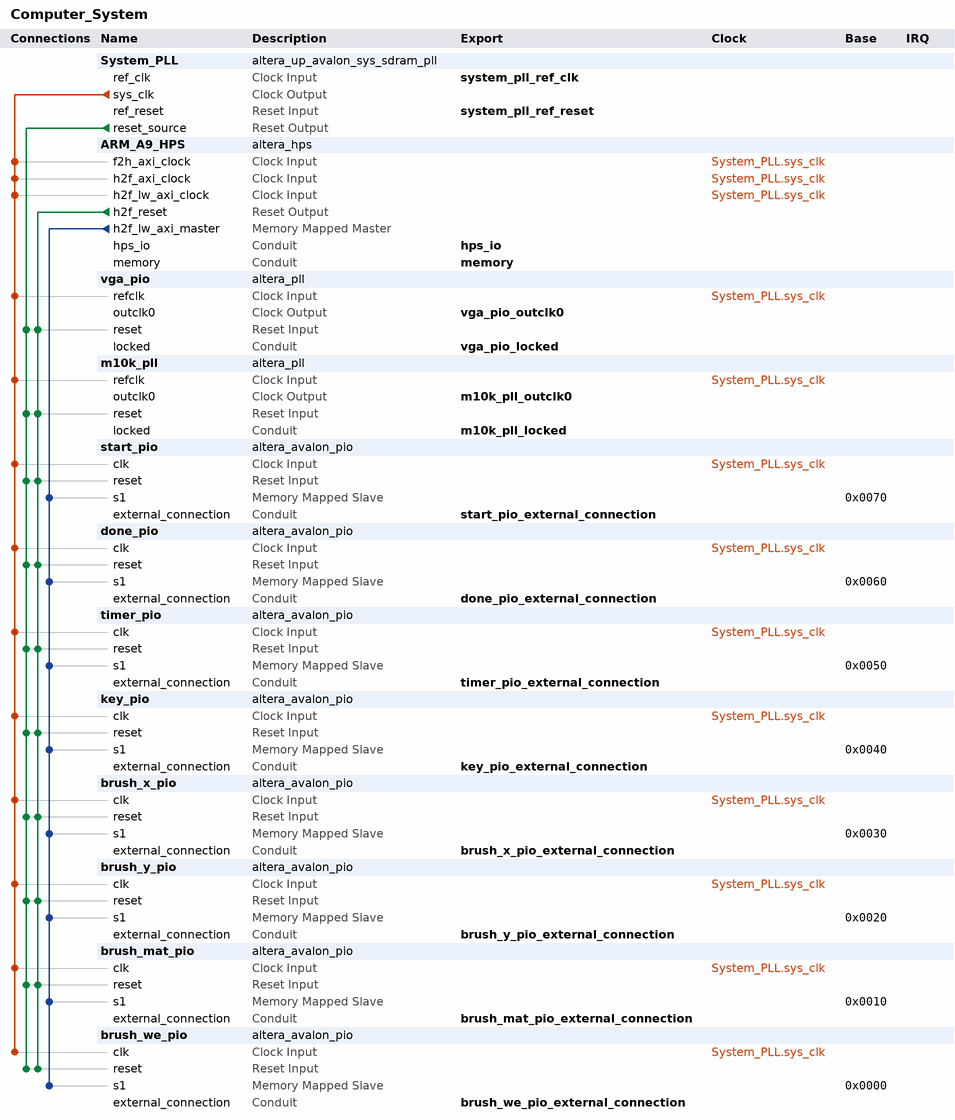
[diagram p0: system contents]
# Platform Designer (Qsys) system Computer_System, Cyclone V 5CSEMA5F31C6
# Parameters at their usual value, and those the tool derives, are not listed.
package require -exact qsys 18.1
create_system Computer_System
set_project_property DEVICE_FAMILY {Cyclone V}
set_project_property DEVICE 5CSEMA5F31C6

add_instance System_PLL altera_up_avalon_sys_sdram_pll 18.0
set_instance_parameter_value System_PLL CV_boards DE1-SoC
set_instance_parameter_value System_PLL gui_outclk 100.0
set_instance_parameter_value System_PLL gui_refclk 50.0

add_instance ARM_A9_HPS altera_hps 18.1
set_instance_parameter_value ARM_A9_HPS EMAC1_Mode RGMII
set_instance_parameter_value ARM_A9_HPS EMAC1_PinMuxing {HPS I/O Set 0}
set_instance_parameter_value ARM_A9_HPS F2SCLK_COLDRST_Enable false
set_instance_parameter_value ARM_A9_HPS F2SCLK_DBGRST_Enable false
set_instance_parameter_value ARM_A9_HPS F2SCLK_WARMRST_Enable false
set_instance_parameter_value ARM_A9_HPS F2SINTERRUPT_Enable true
set_instance_parameter_value ARM_A9_HPS F2S_Width 2
set_instance_parameter_value ARM_A9_HPS FPGA_PERIPHERAL_OUTPUT_CLOCK_FREQ_EMAC0_GTX_CLK 125
set_instance_parameter_value ARM_A9_HPS FPGA_PERIPHERAL_OUTPUT_CLOCK_FREQ_EMAC0_MD_CLK 100.0
set_instance_parameter_value ARM_A9_HPS FPGA_PERIPHERAL_OUTPUT_CLOCK_FREQ_EMAC1_GTX_CLK 125
set_instance_parameter_value ARM_A9_HPS FPGA_PERIPHERAL_OUTPUT_CLOCK_FREQ_EMAC1_MD_CLK 100.0
set_instance_parameter_value ARM_A9_HPS HPS_PROTOCOL DDR3
set_instance_parameter_value ARM_A9_HPS I2C0_Mode I2C
set_instance_parameter_value ARM_A9_HPS I2C0_PinMuxing {HPS I/O Set 0}
set_instance_parameter_value ARM_A9_HPS I2C1_Mode I2C
set_instance_parameter_value ARM_A9_HPS I2C1_PinMuxing {HPS I/O Set 0}
set_instance_parameter_value ARM_A9_HPS LWH2F_Enable true
set_instance_parameter_value ARM_A9_HPS MEM_BANKADDR_WIDTH 3
set_instance_parameter_value ARM_A9_HPS MEM_CLK_FREQ 400.0
set_instance_parameter_value ARM_A9_HPS MEM_COL_ADDR_WIDTH 10
set_instance_parameter_value ARM_A9_HPS MEM_DQ_WIDTH 32
set_instance_parameter_value ARM_A9_HPS MEM_DRV_STR RZQ/7
set_instance_parameter_value ARM_A9_HPS MEM_ROW_ADDR_WIDTH 15
set_instance_parameter_value ARM_A9_HPS MEM_RTT_NOM RZQ/4
set_instance_parameter_value ARM_A9_HPS MEM_RTT_WR RZQ/4
set_instance_parameter_value ARM_A9_HPS MEM_TCL 11
set_instance_parameter_value ARM_A9_HPS MEM_TFAW_NS 30.0
set_instance_parameter_value ARM_A9_HPS MEM_TRAS_NS 35.0
set_instance_parameter_value ARM_A9_HPS MEM_TRCD_NS 13.75
set_instance_parameter_value ARM_A9_HPS MEM_TRFC_NS 260.0
set_instance_parameter_value ARM_A9_HPS MEM_TRP_NS 13.75
set_instance_parameter_value ARM_A9_HPS MEM_VENDOR JEDEC
set_instance_parameter_value ARM_A9_HPS MEM_WTCL 8
set_instance_parameter_value ARM_A9_HPS QSPI_Mode {1 SS}
set_instance_parameter_value ARM_A9_HPS QSPI_PinMuxing {HPS I/O Set 0}
set_instance_parameter_value ARM_A9_HPS REF_CLK_FREQ 25.0
set_instance_parameter_value ARM_A9_HPS S2FCLK_USER2CLK 5
set_instance_parameter_value ARM_A9_HPS S2F_Width 3
set_instance_parameter_value ARM_A9_HPS SDIO_Mode {4-bit Data}
set_instance_parameter_value ARM_A9_HPS SDIO_PinMuxing {HPS I/O Set 0}
set_instance_parameter_value ARM_A9_HPS SPIM1_Mode {Single Slave Select}
set_instance_parameter_value ARM_A9_HPS SPIM1_PinMuxing {HPS I/O Set 0}
set_instance_parameter_value ARM_A9_HPS STM_Enable false
set_instance_parameter_value ARM_A9_HPS TIMING_BOARD_AC_SKEW 0.03
set_instance_parameter_value ARM_A9_HPS TIMING_BOARD_AC_TO_CK_SKEW 0.0
set_instance_parameter_value ARM_A9_HPS TIMING_BOARD_DQ_TO_DQS_SKEW 0.0
set_instance_parameter_value ARM_A9_HPS TIMING_BOARD_MAX_CK_DELAY 0.03
set_instance_parameter_value ARM_A9_HPS TIMING_BOARD_MAX_DQS_DELAY 0.02
set_instance_parameter_value ARM_A9_HPS TIMING_BOARD_SKEW_BETWEEN_DQS 0.08
set_instance_parameter_value ARM_A9_HPS TIMING_BOARD_SKEW_CKDQS_DIMM_MAX 0.16
set_instance_parameter_value ARM_A9_HPS TIMING_BOARD_SKEW_CKDQS_DIMM_MIN 0.09
set_instance_parameter_value ARM_A9_HPS TIMING_BOARD_SKEW_WITHIN_DQS 0.01
set_instance_parameter_value ARM_A9_HPS TIMING_TDH 65
set_instance_parameter_value ARM_A9_HPS TIMING_TDQSCK 255
set_instance_parameter_value ARM_A9_HPS TIMING_TDQSQ 125
set_instance_parameter_value ARM_A9_HPS TIMING_TDS 30
set_instance_parameter_value ARM_A9_HPS TIMING_TIH 140
set_instance_parameter_value ARM_A9_HPS TIMING_TIS 180
set_instance_parameter_value ARM_A9_HPS TIMING_TQSH 0.4
set_instance_parameter_value ARM_A9_HPS UART0_Mode {No Flow Control}
set_instance_parameter_value ARM_A9_HPS UART0_PinMuxing {HPS I/O Set 0}
set_instance_parameter_value ARM_A9_HPS USB1_Mode SDR
set_instance_parameter_value ARM_A9_HPS USB1_PinMuxing {HPS I/O Set 0}
set_instance_parameter_value ARM_A9_HPS desired_cfg_clk_mhz 100.0
set_instance_parameter_value ARM_A9_HPS desired_qspi_clk_mhz 400.0

add_instance vga_pio altera_pll 18.1
set_instance_parameter_value vga_pio gui_device_speed_grade 2
set_instance_parameter_value vga_pio gui_number_of_clocks 1
set_instance_parameter_value vga_pio gui_operation_mode direct
set_instance_parameter_value vga_pio gui_output_clock_frequency0 25.0
set_instance_parameter_value vga_pio gui_pll_mode {Integer-N PLL}
set_instance_parameter_value vga_pio gui_reference_clock_frequency 100.0
set_instance_parameter_value vga_pio gui_use_locked true

add_instance m10k_pll altera_pll 18.1
set_instance_parameter_value m10k_pll gui_device_speed_grade 2
set_instance_parameter_value m10k_pll gui_number_of_clocks 1
set_instance_parameter_value m10k_pll gui_operation_mode direct
set_instance_parameter_value m10k_pll gui_output_clock_frequency0 100.0
set_instance_parameter_value m10k_pll gui_pll_mode {Integer-N PLL}
set_instance_parameter_value m10k_pll gui_reference_clock_frequency 100.0
set_instance_parameter_value m10k_pll gui_use_locked true

add_instance start_pio altera_avalon_pio 18.1
set_instance_parameter_value start_pio direction Output
set_instance_parameter_value start_pio width 32

add_instance done_pio altera_avalon_pio 18.1
set_instance_parameter_value done_pio direction Input
set_instance_parameter_value done_pio width 1

add_instance timer_pio altera_avalon_pio 18.1
set_instance_parameter_value timer_pio direction Input
set_instance_parameter_value timer_pio width 32

add_instance key_pio altera_avalon_pio 18.1
set_instance_parameter_value key_pio direction Input
set_instance_parameter_value key_pio width 4

add_instance brush_x_pio altera_avalon_pio 18.1
set_instance_parameter_value brush_x_pio direction Output
set_instance_parameter_value brush_x_pio width 10

add_instance brush_y_pio altera_avalon_pio 18.1
set_instance_parameter_value brush_y_pio direction Output
set_instance_parameter_value brush_y_pio width 9

add_instance brush_mat_pio altera_avalon_pio 18.1
set_instance_parameter_value brush_mat_pio direction Output
set_instance_parameter_value brush_mat_pio width 5

add_instance brush_we_pio altera_avalon_pio 18.1
set_instance_parameter_value brush_we_pio direction Output
set_instance_parameter_value brush_we_pio width 1

# connections
add_connection System_PLL.sys_clk ARM_A9_HPS.f2h_axi_clock clock
add_connection System_PLL.sys_clk ARM_A9_HPS.h2f_axi_clock clock
add_connection System_PLL.sys_clk ARM_A9_HPS.h2f_lw_axi_clock clock
add_connection System_PLL.sys_clk brush_mat_pio.clk clock
add_connection System_PLL.sys_clk brush_we_pio.clk clock
add_connection System_PLL.sys_clk brush_x_pio.clk clock
add_connection System_PLL.sys_clk brush_y_pio.clk clock
add_connection System_PLL.sys_clk done_pio.clk clock
add_connection System_PLL.sys_clk key_pio.clk clock
add_connection System_PLL.sys_clk m10k_pll.refclk clock
add_connection System_PLL.sys_clk start_pio.clk clock
add_connection System_PLL.sys_clk timer_pio.clk clock
add_connection System_PLL.sys_clk vga_pio.refclk clock
add_connection ARM_A9_HPS.h2f_reset brush_mat_pio.reset reset
add_connection ARM_A9_HPS.h2f_reset brush_we_pio.reset reset
add_connection ARM_A9_HPS.h2f_reset brush_x_pio.reset reset
add_connection ARM_A9_HPS.h2f_reset brush_y_pio.reset reset
add_connection ARM_A9_HPS.h2f_reset done_pio.reset reset
add_connection ARM_A9_HPS.h2f_reset key_pio.reset reset
add_connection ARM_A9_HPS.h2f_reset m10k_pll.reset reset
add_connection ARM_A9_HPS.h2f_reset start_pio.reset reset
add_connection ARM_A9_HPS.h2f_reset timer_pio.reset reset
add_connection ARM_A9_HPS.h2f_reset vga_pio.reset reset
add_connection System_PLL.reset_source brush_mat_pio.reset reset
add_connection System_PLL.reset_source brush_we_pio.reset reset
add_connection System_PLL.reset_source brush_x_pio.reset reset
add_connection System_PLL.reset_source brush_y_pio.reset reset
add_connection System_PLL.reset_source done_pio.reset reset
add_connection System_PLL.reset_source key_pio.reset reset
add_connection System_PLL.reset_source m10k_pll.reset reset
add_connection System_PLL.reset_source start_pio.reset reset
add_connection System_PLL.reset_source timer_pio.reset reset
add_connection System_PLL.reset_source vga_pio.reset reset
add_connection ARM_A9_HPS.h2f_lw_axi_master brush_mat_pio.s1 avalon
set_connection_parameter_value ARM_A9_HPS.h2f_lw_axi_master/brush_mat_pio.s1 baseAddress 0x0010
add_connection ARM_A9_HPS.h2f_lw_axi_master brush_we_pio.s1 avalon
set_connection_parameter_value ARM_A9_HPS.h2f_lw_axi_master/brush_we_pio.s1 baseAddress 0x0000
add_connection ARM_A9_HPS.h2f_lw_axi_master brush_x_pio.s1 avalon
set_connection_parameter_value ARM_A9_HPS.h2f_lw_axi_master/brush_x_pio.s1 baseAddress 0x0030
add_connection ARM_A9_HPS.h2f_lw_axi_master brush_y_pio.s1 avalon
set_connection_parameter_value ARM_A9_HPS.h2f_lw_axi_master/brush_y_pio.s1 baseAddress 0x0020
add_connection ARM_A9_HPS.h2f_lw_axi_master done_pio.s1 avalon
set_connection_parameter_value ARM_A9_HPS.h2f_lw_axi_master/done_pio.s1 baseAddress 0x0060
add_connection ARM_A9_HPS.h2f_lw_axi_master key_pio.s1 avalon
set_connection_parameter_value ARM_A9_HPS.h2f_lw_axi_master/key_pio.s1 baseAddress 0x0040
add_connection ARM_A9_HPS.h2f_lw_axi_master start_pio.s1 avalon
set_connection_parameter_value ARM_A9_HPS.h2f_lw_axi_master/start_pio.s1 baseAddress 0x0070
add_connection ARM_A9_HPS.h2f_lw_axi_master timer_pio.s1 avalon
set_connection_parameter_value ARM_A9_HPS.h2f_lw_axi_master/timer_pio.s1 baseAddress 0x0050

# exported interfaces
add_interface brush_mat_pio_external_connection conduit end
set_interface_property brush_mat_pio_external_connection EXPORT_OF brush_mat_pio.external_connection
add_interface brush_we_pio_external_connection conduit end
set_interface_property brush_we_pio_external_connection EXPORT_OF brush_we_pio.external_connection
add_interface brush_x_pio_external_connection conduit end
set_interface_property brush_x_pio_external_connection EXPORT_OF brush_x_pio.external_connection
add_interface brush_y_pio_external_connection conduit end
set_interface_property brush_y_pio_external_connection EXPORT_OF brush_y_pio.external_connection
add_interface done_pio_external_connection conduit end
set_interface_property done_pio_external_connection EXPORT_OF done_pio.external_connection
add_interface hps_io conduit end
set_interface_property hps_io EXPORT_OF ARM_A9_HPS.hps_io
add_interface key_pio_external_connection conduit end
set_interface_property key_pio_external_connection EXPORT_OF key_pio.external_connection
add_interface m10k_pll_locked conduit end
set_interface_property m10k_pll_locked EXPORT_OF m10k_pll.locked
add_interface m10k_pll_outclk0 clock source
set_interface_property m10k_pll_outclk0 EXPORT_OF m10k_pll.outclk0
add_interface memory conduit end
set_interface_property memory EXPORT_OF ARM_A9_HPS.memory
add_interface start_pio_external_connection conduit end
set_interface_property start_pio_external_connection EXPORT_OF start_pio.external_connection
add_interface system_pll_ref_clk clock sink
set_interface_property system_pll_ref_clk EXPORT_OF System_PLL.ref_clk
add_interface system_pll_ref_reset reset sink
set_interface_property system_pll_ref_reset EXPORT_OF System_PLL.ref_reset
add_interface timer_pio_external_connection conduit end
set_interface_property timer_pio_external_connection EXPORT_OF timer_pio.external_connection
add_interface vga_pio_locked conduit end
set_interface_property vga_pio_locked EXPORT_OF vga_pio.locked
add_interface vga_pio_outclk0 clock source
set_interface_property vga_pio_outclk0 EXPORT_OF vga_pio.outclk0

set_interconnect_requirement {$system} qsys_mm.clockCrossingAdapter HANDSHAKE
set_interconnect_requirement {$system} qsys_mm.enableEccProtection FALSE
set_interconnect_requirement {$system} qsys_mm.insertDefaultSlave FALSE
set_interconnect_requirement {$system} qsys_mm.maxAdditionalLatency 1

save_system Computer_System.qsys
